# Altium schematic sheet Battery charger.SchDoc
size A; SheetNumber: 3; SheetTotal: 6
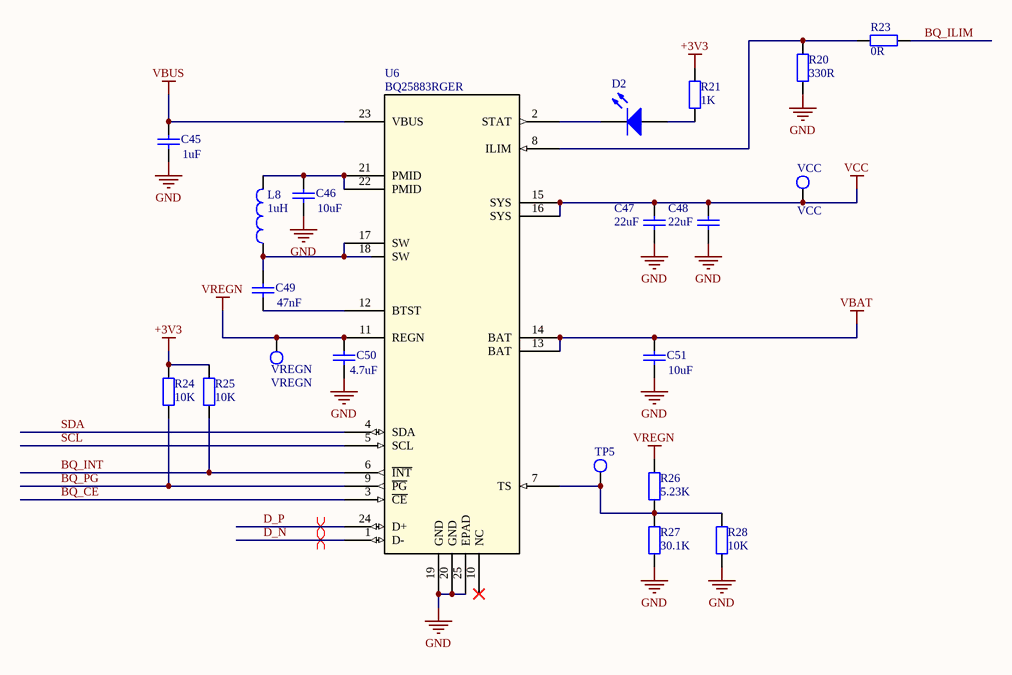
[diagram p0: Battery charger.SchDoc]

## Parts
C45  1uF  [SMD-0402C]
C46  10uF  [SMD-0805C]
C47  22uF  [SMD-0805C]
C48  22uF  [SMD-0805C]
C49  47nF  [SMD-0402C]
C50  4.7uF  [SMD-0603C]
C51  10uF  [SMD-0805C]
D2  (no value)  [LED 0603]
L8  1uH  [SMD-0806_L]
R20  330R  [SMD-0402-RES]
R21  1K  [SMD-0402-RES]
R23  0R  [SMD-0402-RES]
R24  10K  [SMD-0402-RES]
R25  10K  [SMD-0402-RES]
R26  5.23K  [SMD-0402-RES]
R27  30.1K  [SMD-0402-RES]
R28  10K  [SMD-0402-RES]
TP5  VREGN  [testpoint 1 mm]  (value not drawn)  (no BOM)
U6  BQ25883RGER  [BQ25883RGER]
VCC  VCC  [testpoint 1 mm]  (no BOM)
VREGN  VREGN  [testpoint 1 mm]  (no BOM)

## Nets
+3V3: R21.1 R24.2 R25.2
GND: C45.1 C46.1 C47.1 C48.1 C50.1 C51.1 R20.1 R27.1 R28.1 U6.19(GND) U6.20(GND) U6.25(EPAD)
VBAT: C51.2 U6.13(BAT) U6.14(BAT)
VBUS: C45.2 U6.23(VBUS)
VCC: C47.2 C48.2 U6.15(SYS) U6.16(SYS) VCC.1
VREGN: C50.2 R26.2 U6.11(REGN) VREGN.1
BQ_CE: U6.3(~{CE})
BQ_ILIM: R23.1
BQ_INT: R25.1 U6.6(~{INT})
BQ_PG: R24.1 U6.9(~{PG})
D_N: U6.1(D-)
D_P: U6.24(D+)
SCL: U6.5(SCL)
SDA: U6.4(SDA)
NetC46_2: C46.2 L8.2 U6.21(PMID) U6.22(PMID)
NetC49_1: C49.1 U6.12(BTST)
NetC49_2: C49.2 L8.1 U6.17(SW) U6.18(SW)
NetD2_1: D2.1(A) R21.2
NetD2_2: D2.2(K) U6.2(STAT)
NetR20_2: R20.2 R23.2 U6.8(ILIM)
NetR26_1: R26.1 R27.2 R28.2 TP5.1 U6.7(TS)

Not connected (* = marked no-connect by the designer): U6 10(NC)*

## Layout directives
differential pair: D_N, D_P

## Library data of the parts
C45-C51 = Cap: Capacitor; Published: 8-Jun-2000; LatestRevisionDate: 17-Jul-2002; LatestRevisionNote: Re-released for DXP Platform.; PackageReference: RAD-0.3; Publisher: Altium Limited; PackageDescription: Radial Cap, Thru-Hole; 2 Leads; 0.3 in Pin Spacing; Supplier 1: Mouser
  C45: Value: 1uF; Supplier Part Number 1: 81-GRM155R61E105KA2D
  C46 C51: Value: 10uF; Supplier Part Number 1: 187-CL21A106KOQNNNG
  C47 C48: Value: 22uF; Supplier Part Number 1: 187-CL21A226MAYNNNE
  C49: Value: 47nF; Supplier Part Number 1: 81-GRM155R71H473KE4D
  C50: Value: 4.7uF; Supplier Part Number 1: 187-CL10A475KO8NNNC
D2 = LED1: Single Colour LEDs SMD Green 2.5-16 mcd; Published: 8-Jun-2000; LatestRevisionDate: 08-Jul-2005; LatestRevisionNote: Mech Layer 1 removed.; PackageReference: LED-1; Publisher: Altium Limited; PackageDescription: LED; 2 Leads; Supplier 1: Mouser; Supplier Part Number 1: 755-SML-D12P8WT86
L8 = Inductor: Code_IEC: 1005; Published: 8-Jun-2000; LatestRevisionDate: 29-May-2009; LatestRevisionNote: IPC-7351 Footprint Added.; PackageReference: 0402-A; Publisher: Altium Limited; PackageDescription: Chip Inductor; Code_JEITA: 0402; Value: 1uH; Supplier 1: Mouser; Supplier Part Number 1: 815-AOTB201610S1R0MT
R20 R21 R23-R28 = Res2: Resistor; Published: 8-Jun-2000; LatestRevisionDate: 17-Jul-2002; LatestRevisionNote: Re-released for DXP Platform.; PackageReference: AXIAL-0.4; Publisher: Altium Limited; PackageDescription: Axial Device, Thru-Hole; 2 Leads; 0.4 in Pin Spacing; Supplier 1: Mouser
  R20: Value: 330R; Supplier Part Number 1: 652-CR0402FX-3300GLF
  R21: Value: 1K; Supplier Part Number 1: 708-RMCF0402FT1K00
  R23: Value: 0R; Supplier Part Number 1: 603-RC0402FR-070RL
  R24 R25 R28: Value: 10K; Supplier Part Number 1: 603-RC0402FR-7D10KL
  R26: Value: 5.23K; Supplier Part Number 1: 708-RMCF0402FT5K23
  R27: Value: 30.1K; Supplier Part Number 1: 708-RMCF0402FT30K1
TP5 VCC VREGN = testpoint
U6 = BQ25883RGER: I2C 2 cell 2A Boost battery charger for USB input in a WQFN package with Power Path 24-VQFN -40 to 85; Manufacturer_Name: Texas Instruments; Copyright: Copyright (C) 2025 Ultra Librarian. All rights reserved.; Manufacturer_Part_Number: BQ25883RGER; RefDes: RefDes; Type: Type; Supplier 1: Mouser; Supplier Part Number 1: 595-BQ25883RGER